# Altium schematic sheet led.SchDoc
size A4
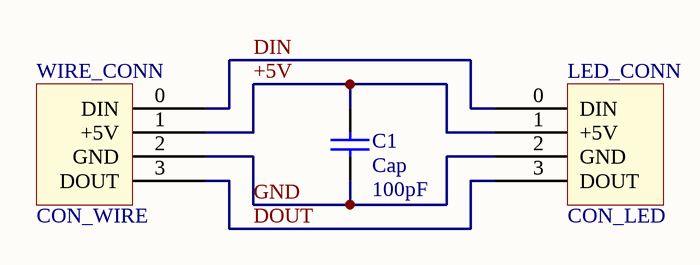
[diagram p0: led.SchDoc]

## Parts
C1  Cap  value 100pF  [RAD-0.3]
LED_CONN  CON_LED
WIRE_CONN  CON_WIRE

## Nets
+5V: C1.2 LED_CONN.1(+5V) WIRE_CONN.1(+5V)
DIN: LED_CONN.0(DIN) WIRE_CONN.0(DIN)
DOUT: LED_CONN.3(DOUT) WIRE_CONN.3(DOUT)
GND: C1.1 LED_CONN.2(GND) WIRE_CONN.2(GND)

## Library data of the parts
C1 = Cap: Capacitor; Published: 8-Jun-2000; LatestRevisionDate: 17-Jul-2002; LatestRevisionNote: Re-released for DXP Platform.; PackageReference: RAD-0.3; Publisher: Altium Limited; PackageDescription: Radial Cap, Thru-Hole; 2 Leads; 0.3 in Pin Spacing